# EAGLE design LED_Driver (EAGLE 7.6.0)
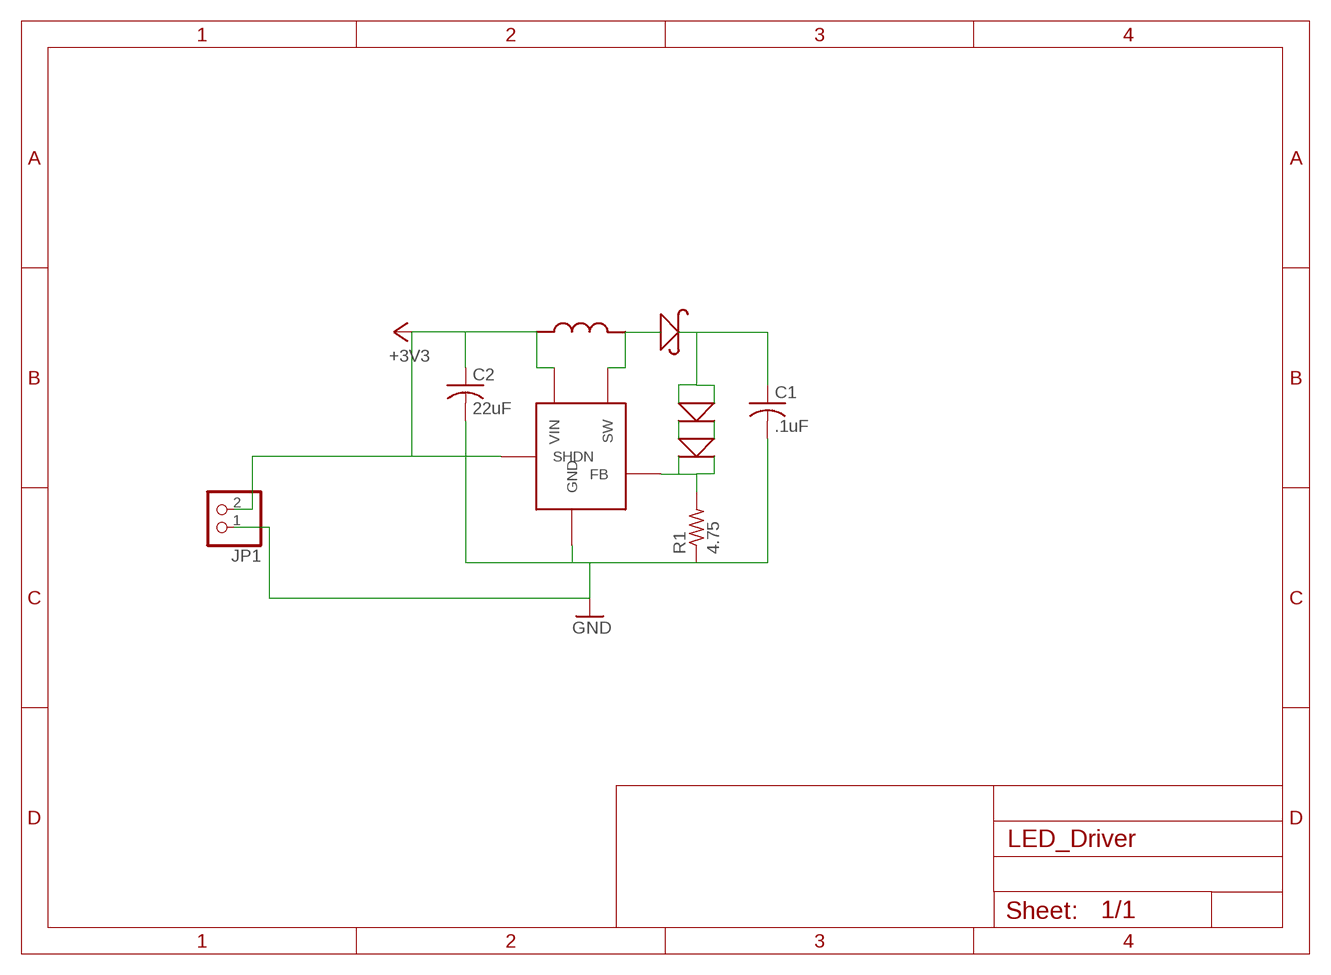
[diagram p0: schematic, sheet 1]

## Parts
C1  .1uF  C-USC0603  [C0603]
C2  22uF  C-USC0603  [C0603]
JP1  PINHD-1X2  [1X02]
R1  4.75  R-US_R0603  [R0603]
U$1  LT1937  [TSOT-23]
U$2  NLCV25-PF  [NLCV25-PF]
U$3  DB2J310  [DB2J310]
U$4  CLA2A-WKW-CYBZ0343CT  [CLA2A-WKW-CYBZ0343CT]
U$5  CLA2A-WKW-CYBZ0343CT  [CLA2A-WKW-CYBZ0343CT]

## Nets
+3V3: C2.1 JP1.2 U$1.P$4(SHDN) U$1.P$5(VIN) U$2.P$1
GND: C1.2 C2.2 JP1.1 R1.1 U$1.P$2(GND)
N$1: U$4.P$4(GND2) U$5.P$2(VIN2)
N$2: U$1.P$1(SW) U$2.P$2 U$3.P$2(VIN)
N$3: C1.1 U$3.P$1(GND) U$4.P$1(VIN1) U$4.P$2(VIN2)
N$4: U$4.P$3(GND1) U$5.P$1(VIN1)
N$6: R1.2 U$1.P$3(FB) U$5.P$3(GND1) U$5.P$4(GND2)

## Library data of the parts
C1 C2 = resistor:C-US: CAPACITOR, American symbol
JP1 = pinhead:PINHD-1X2: PIN HEADER
R1 = resistor:R-US_: RESISTOR, American symbol
U$1 = LED:LT1937
U$2 = LED:NLCV25-PF
U$3 = LED:DB2J310
U$4 U$5 = LED:CLA2A-WKW-CYBZ0343CT

## Board
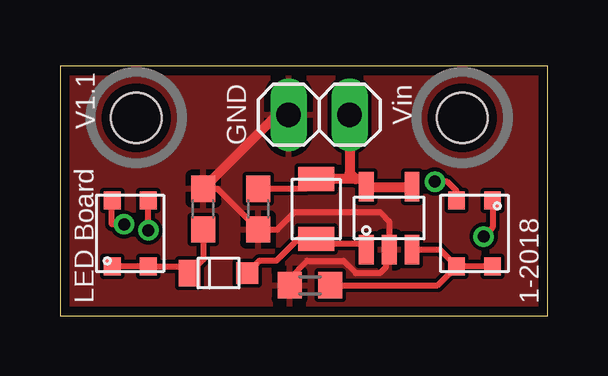
[diagram p1: board, top side]
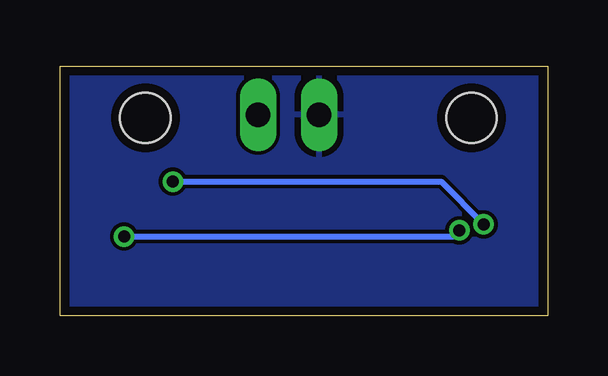
[diagram p2: board, bottom side, seen from below]

Size 20.32 x 10.41 mm. Coordinates in mm from the lower left corner, seen from the top.
Outline: 0,0 20.32,0 20.32,10.41 0,10.41 0,0
Copper layers (1*16): Top 0.0356mm / dielectric 1.5011mm / Bottom 0.0356mm
Design rules "OshPark": minimum track width 6mil, minimum drill 13mil, track to track 6mil, track to pad 6mil, pad to pad 6mil, via to via 6mil, smd to smd 6mil, copper to edge 15mil, drill to drill 6mil, minimum pad ring 7mil, minimum via ring 7mil, stop-mask expansion 3mil, vias tented up to drill 0mil, thermal gap 10mil
Holes 2.1 mm at 3.17,8.26 16.76,8.26

### Footprints (pad centres in the part's own frame; a part is rotated, then mirrored left to right if it is on the bottom)
C0603 = smd 1.1 x 1: 1 -0.85,0; 2 0.85,0
1X02 = drill 1.016 long: 1 -1.27,0; 2 1.27,0
R0603 = smd 1 x 1.1: 1 -0.85,0; 2 0.85,0
TSOT-23 = smd 0.62 x 1.22: P$1 -0.95,-1.31; P$2 0,-1.31; P$3 0.95,-1.31; P$4 0.95,1.31; P$5 -0.95,1.31
NLCV25-PF = smd 1 x 1.5: P$1 -1.25,0; P$2 1.25,0
DB2J310 = smd 1.1 x 0.9: P$1 0,-1.2 | smd 0.9 x 0.9: P$2 0,1.2
CLA2A-WKW-CYBZ0343CT = smd 0.75 x 0.7: P$1 -1.375,0.75; P$2 -1.375,-0.75; P$3 1.375,-0.75; P$4 1.375,0.75

### Placement (x,y rotation side)
C1  5.97,4.45 90 top
C2  8.26,4.45 270 top
JP1  10.79,8.38 0 top
R1  10.41,1.27 0 top
U$1  13.72,4.06 0 top
U$2  10.67,4.45 270 top
U$3  6.6,1.78 270 top
U$4  2.92,3.43 90 top
U$5  17.27,3.43 270 top

### Tracks (layer width: path | path; a pad name or v marks a point on that pad's centre or on a via)
+3V3
  Top 0.254: C2.1 10.27,5.29 U$2.P$1 | 12.7,5.7 U$1.P$5
  Top 0.406: 12.7,5.7 12.32,5.7 | 12.32,5.7 U$2.P$1 | U$1.P$5 U$1.P$4 | JP1.2 12.06,5.95 12.32,5.7
GND
  Top 0.254: C1.2 6.55,5.29 C2.2 9.06,3.6 9.78,4.32 13.34,4.32 13.72,3.94 U$1.P$2 | 13.59,3.13 U$1.P$2 | R1.1 9.56,1.56 10.29,2.29 11.81,2.29 12.32,1.78 13.34,1.78 13.59,2.03 13.59,2.63 U$1.P$2
  Top 0.406: JP1.1 9.06,8.38 C1.2
  pour Bottom: -5.71,12.7 27.3,12.7 27.3,-1.27 -5.71,-1.27
  pour Top: -6.99,11.43 26.04,11.43 26.04,-1.27 -6.99,-1.27
N$1  (via drill 0.5)
  Top 0.254: U$5.P$2 16.52,5.2 16.13,5.59 v15.62,5.59 | 2.16,4.82 U$4.P$4 2.16,4.79 2.16,3.81 v2.67,3.81
  Bottom 0.254: v15.62,5.59 4.45,5.59 v2.67,3.81
N$2
  Top 0.254: U$3.P$2 8.31,2.29 9.02,2.29 9.93,3.19 U$2.P$2 10.86,3.01 12.51,3.01 U$1.P$1
N$3
  Top 0.254: C1.1 5.97,2.34 U$3.P$1 5.13,2.05 U$4.P$2 U$4.P$1
N$4  (via drill 0.5)
  Top 0.254: U$5.P$1 18.02,3.67 v17.65,3.3 | v3.68,3.56 3.68,4.79 U$4.P$3
  Bottom 0.254: v17.65,3.3 3.94,3.3 v3.68,3.56
N$6
  Top 0.254: U$5.P$4 U$5.P$3 | 14.61,2.95 U$1.P$3 15.82,2.75 U$5.P$3 | R1.2 15.74,1.27 U$5.P$3

### Text on the board
tPlace: V1.1 | Vin | GND | LED Board | 1-2018